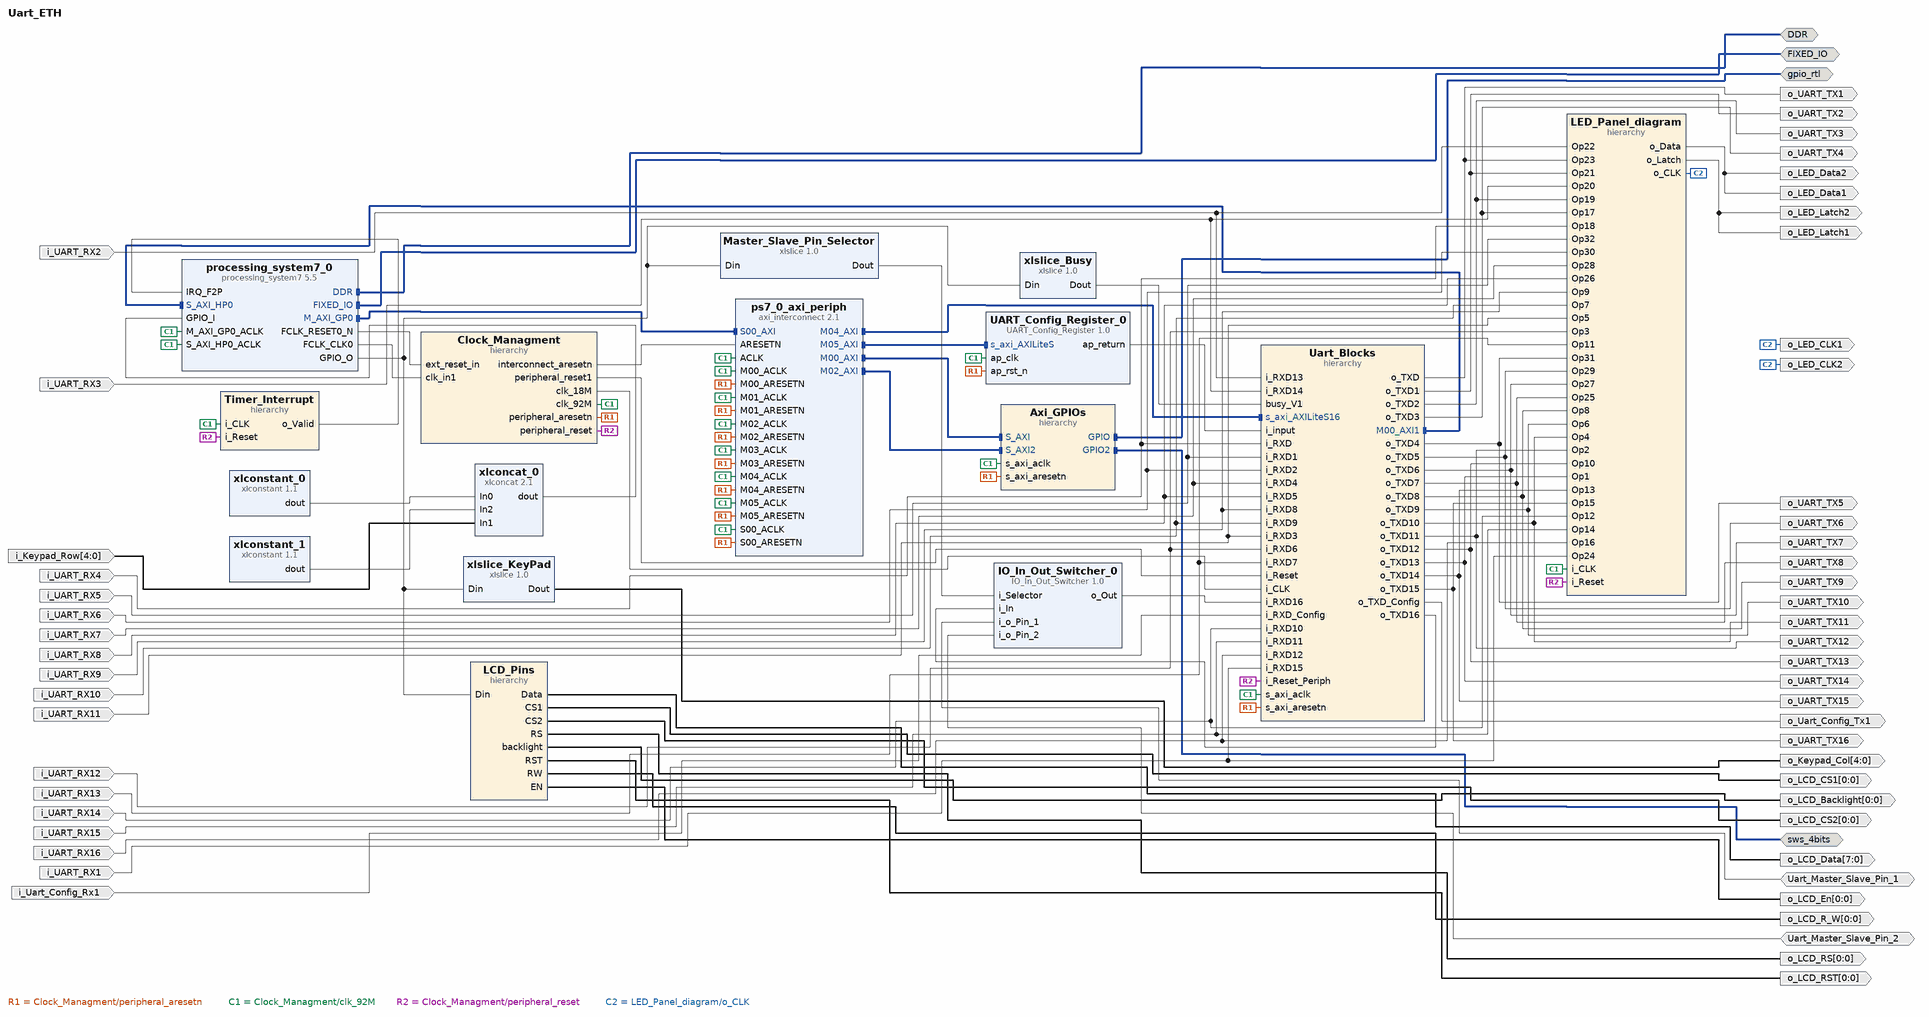
[diagram p0: block diagram of the top level]
# Vivado block design Uart_ETH, xc7z020clg400-1, Vivado 2017.2
create_bd_design Uart_ETH

create_bd_intf_port -mode Master -vlnv xilinx.com:interface:ddrx_rtl:1.0 DDR
create_bd_intf_port -mode Master -vlnv xilinx.com:display_processing_system7:fixedio_rtl:1.0 FIXED_IO
create_bd_intf_port -mode Master -vlnv xilinx.com:interface:gpio_rtl:1.0 gpio_rtl
create_bd_intf_port -mode Master -vlnv xilinx.com:interface:gpio_rtl:1.0 sws_4bits
create_bd_port -dir I i_UART_RX2
create_bd_port -dir I i_UART_RX3
create_bd_port -dir I i_UART_RX4
create_bd_port -dir I i_UART_RX5
create_bd_port -dir I i_UART_RX6
create_bd_port -dir I i_UART_RX7
create_bd_port -dir I i_UART_RX8
create_bd_port -dir I i_UART_RX9
create_bd_port -dir I i_UART_RX10
create_bd_port -dir I i_UART_RX11
create_bd_port -dir I i_UART_RX12
create_bd_port -dir I i_UART_RX13
create_bd_port -dir I i_UART_RX14
create_bd_port -dir I i_UART_RX15
create_bd_port -dir I i_UART_RX16
create_bd_port -dir I i_UART_RX1
create_bd_port -dir O o_UART_TX1
create_bd_port -dir O o_UART_TX2
create_bd_port -dir O o_UART_TX3
create_bd_port -dir O o_UART_TX4
create_bd_port -dir O o_UART_TX5
create_bd_port -dir O o_UART_TX6
create_bd_port -dir O o_UART_TX7
create_bd_port -dir O o_UART_TX8
create_bd_port -dir O o_UART_TX9
create_bd_port -dir O o_UART_TX10
create_bd_port -dir O o_UART_TX11
create_bd_port -dir O o_UART_TX12
create_bd_port -dir O o_UART_TX13
create_bd_port -dir O o_UART_TX14
create_bd_port -dir O o_UART_TX15
create_bd_port -dir O o_UART_TX16
create_bd_port -dir O -type clk o_LED_CLK1
create_bd_port -dir O -type clk o_LED_CLK2
create_bd_port -dir O o_LED_Data1
create_bd_port -dir O o_LED_Data2
create_bd_port -dir O o_LED_Latch1
create_bd_port -dir O o_LED_Latch2
create_bd_port -dir O -from 4 -to 0 o_Keypad_Col
create_bd_port -dir I -from 4 -to 0 i_Keypad_Row
create_bd_port -dir O -from 7 -to 0 o_LCD_Data
create_bd_port -dir O -from 0 -to 0 o_LCD_CS1
create_bd_port -dir O -from 0 -to 0 o_LCD_CS2
create_bd_port -dir O -from 0 -to 0 o_LCD_RS
create_bd_port -dir O -from 0 -to 0 o_LCD_RST
create_bd_port -dir O -from 0 -to 0 o_LCD_R_W
create_bd_port -dir O -from 0 -to 0 o_LCD_Backlight
create_bd_port -dir O -from 0 -to 0 o_LCD_En
create_bd_port -dir O o_Uart_Config_Tx1
create_bd_port -dir I i_Uart_Config_Rx1
create_bd_port -dir IO Uart_Master_Slave_Pin_1
create_bd_port -dir IO Uart_Master_Slave_Pin_2

create_bd_cell -type ip -vlnv xilinx.com:ip:processing_system7:5.5 processing_system7_0
set_property -dict [list \
  CONFIG.PCW_FCLK_CLK1_BUF TRUE \
  CONFIG.PCW_APU_PERIPHERAL_FREQMHZ 666.666666 \
  CONFIG.PCW_SDIO_PERIPHERAL_FREQMHZ 100 \
  CONFIG.PCW_UART_PERIPHERAL_FREQMHZ 100 \
  CONFIG.PCW_FPGA0_PERIPHERAL_FREQMHZ 100 \
  CONFIG.PCW_FPGA1_PERIPHERAL_FREQMHZ 125 \
  CONFIG.PCW_USE_S_AXI_HP0 1 \
  CONFIG.PCW_USE_FABRIC_INTERRUPT 1 \
  CONFIG.PCW_UART1_BAUD_RATE 921600 \
  CONFIG.PCW_EN_CLK1_PORT 1 \
  CONFIG.PCW_EN_RST1_PORT 1 \
  CONFIG.PCW_IRQ_F2P_INTR 1 \
  CONFIG.PCW_PRESET_BANK1_VOLTAGE {LVCMOS 1.8V} \
  CONFIG.PCW_UIPARAM_DDR_PARTNO {MT41J256M16 RE-125} \
  CONFIG.PCW_QSPI_PERIPHERAL_ENABLE 1 \
  CONFIG.PCW_QSPI_GRP_SINGLE_SS_ENABLE 1 \
  CONFIG.PCW_QSPI_GRP_SINGLE_SS_IO {MIO 1 .. 6} \
  CONFIG.PCW_QSPI_GRP_FBCLK_ENABLE 1 \
  CONFIG.PCW_QSPI_GRP_FBCLK_IO {MIO 8} \
  CONFIG.PCW_ENET0_PERIPHERAL_ENABLE 1 \
  CONFIG.PCW_ENET0_ENET0_IO {MIO 16 .. 27} \
  CONFIG.PCW_ENET0_GRP_MDIO_ENABLE 1 \
  CONFIG.PCW_ENET0_GRP_MDIO_IO {MIO 52 .. 53} \
  CONFIG.PCW_ENET0_RESET_ENABLE 1 \
  CONFIG.PCW_ENET0_RESET_IO {MIO 51} \
  CONFIG.PCW_SD0_PERIPHERAL_ENABLE 1 \
  CONFIG.PCW_SD0_SD0_IO {MIO 40 .. 45} \
  CONFIG.PCW_SD0_GRP_CD_ENABLE 1 \
  CONFIG.PCW_SD0_GRP_CD_IO {MIO 46} \
  CONFIG.PCW_SD0_GRP_WP_ENABLE 1 \
  CONFIG.PCW_SD0_GRP_WP_IO {MIO 47} \
  CONFIG.PCW_UART1_PERIPHERAL_ENABLE 1 \
  CONFIG.PCW_UART1_UART1_IO {MIO 48 .. 49} \
  CONFIG.PCW_USB0_PERIPHERAL_ENABLE 1 \
  CONFIG.PCW_USB0_USB0_IO {MIO 28 .. 39} \
  CONFIG.PCW_USB0_RESET_ENABLE 0 \
  CONFIG.PCW_GPIO_PERIPHERAL_ENABLE 1 \
  CONFIG.PCW_GPIO_MIO_GPIO_ENABLE 1 \
  CONFIG.PCW_GPIO_EMIO_GPIO_ENABLE 1 \
  CONFIG.PCW_GPIO_EMIO_GPIO_IO 44 \
  CONFIG.PCW_ENET0_PERIPHERAL_CLKSRC {ARM PLL} \
] [get_bd_cells processing_system7_0]
# 165 more settings of processing_system7_0 are not shown: defaults, MIO pin electricals, DDR timing, and values the tool derives
create_bd_cell -type hier Axi_GPIOs
create_bd_cell -type ip -vlnv xilinx.com:ip:axi_interconnect:2.1 ps7_0_axi_periph
set_property -dict {CONFIG.NUM_MI 6} [get_bd_cells ps7_0_axi_periph]
create_bd_cell -type hier Uart_Blocks
create_bd_cell -type hier Clock_Managment
create_bd_cell -type ip -vlnv xilinx.com:ip:xlslice:1.0 xlslice_Busy
set_property -dict {CONFIG.DIN_TO 0 CONFIG.DIN_FROM 17 CONFIG.DIN_WIDTH 44 CONFIG.DOUT_WIDTH 18} [get_bd_cells xlslice_Busy]
create_bd_cell -type ip -vlnv xilinx.com:ip:xlslice:1.0 xlslice_KeyPad
set_property -dict {CONFIG.DIN_TO 18 CONFIG.DIN_FROM 22 CONFIG.DIN_WIDTH 44 CONFIG.DOUT_WIDTH 5} [get_bd_cells xlslice_KeyPad]
create_bd_cell -type hier LCD_Pins
create_bd_cell -type hier Timer_Interrupt
create_bd_cell -type ip -vlnv xilinx.com:ip:xlconcat:2.1 xlconcat_0
set_property -dict {CONFIG.NUM_PORTS 3 CONFIG.IN0_WIDTH 38 CONFIG.IN1_WIDTH 5} [get_bd_cells xlconcat_0]
create_bd_cell -type ip -vlnv xilinx.com:ip:xlconstant:1.1 xlconstant_0
set_property -dict {CONFIG.CONST_WIDTH 38 CONFIG.CONST_VAL 0} [get_bd_cells xlconstant_0]
create_bd_cell -type ip -vlnv xilinx.com:hls:UART_Config_Register:1.0 UART_Config_Register_0
create_bd_cell -type ip -vlnv xilinx.com:user:IO_In_Out_Switcher:1.0 IO_In_Out_Switcher_0
create_bd_cell -type ip -vlnv xilinx.com:ip:xlconstant:1.1 xlconstant_1
set_property -dict {CONFIG.CONST_WIDTH 1 CONFIG.CONST_VAL 0} [get_bd_cells xlconstant_1]
create_bd_cell -type ip -vlnv xilinx.com:ip:xlslice:1.0 Master_Slave_Pin_Selector
set_property -dict [list \
  CONFIG.DIN_TO 43 \
  CONFIG.DIN_FROM 43 \
  CONFIG.DIN_WIDTH 44 \
  CONFIG.DOUT_WIDTH 1 \
] [get_bd_cells Master_Slave_Pin_Selector]
create_bd_cell -type hier LED_Panel_diagram

# ---- hierarchy /Axi_GPIOs ----
current_bd_instance /Axi_GPIOs
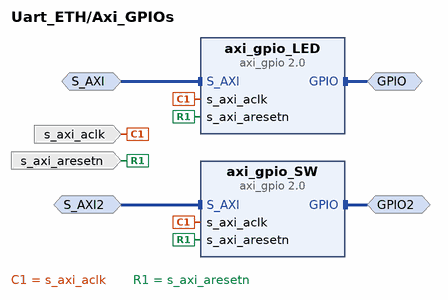
[diagram p1: block diagram inside /Axi_GPIOs]
create_bd_intf_pin -mode Slave -vlnv xilinx.com:interface:aximm_rtl:1.0 S_AXI
create_bd_intf_pin -mode Master -vlnv xilinx.com:interface:gpio_rtl:1.0 GPIO
create_bd_intf_pin -mode Slave -vlnv xilinx.com:interface:aximm_rtl:1.0 S_AXI2
create_bd_intf_pin -mode Master -vlnv xilinx.com:interface:gpio_rtl:1.0 GPIO2
create_bd_pin -dir I -type clk s_axi_aclk
create_bd_pin -dir I -type rst s_axi_aresetn

create_bd_cell -type ip -vlnv xilinx.com:ip:axi_gpio:2.0 axi_gpio_LED
set_property -dict [list \
  CONFIG.C_GPIO_WIDTH 4 \
  CONFIG.USE_BOARD_FLOW true \
  CONFIG.GPIO_BOARD_INTERFACE Custom \
  CONFIG.C_ALL_OUTPUTS 1 \
] [get_bd_cells axi_gpio_LED]
create_bd_cell -type ip -vlnv xilinx.com:ip:axi_gpio:2.0 axi_gpio_SW
set_property -dict {CONFIG.USE_BOARD_FLOW true CONFIG.GPIO_BOARD_INTERFACE sws_4bits} [get_bd_cells axi_gpio_SW]

# ---- hierarchy /Uart_Blocks ----
current_bd_instance /Uart_Blocks
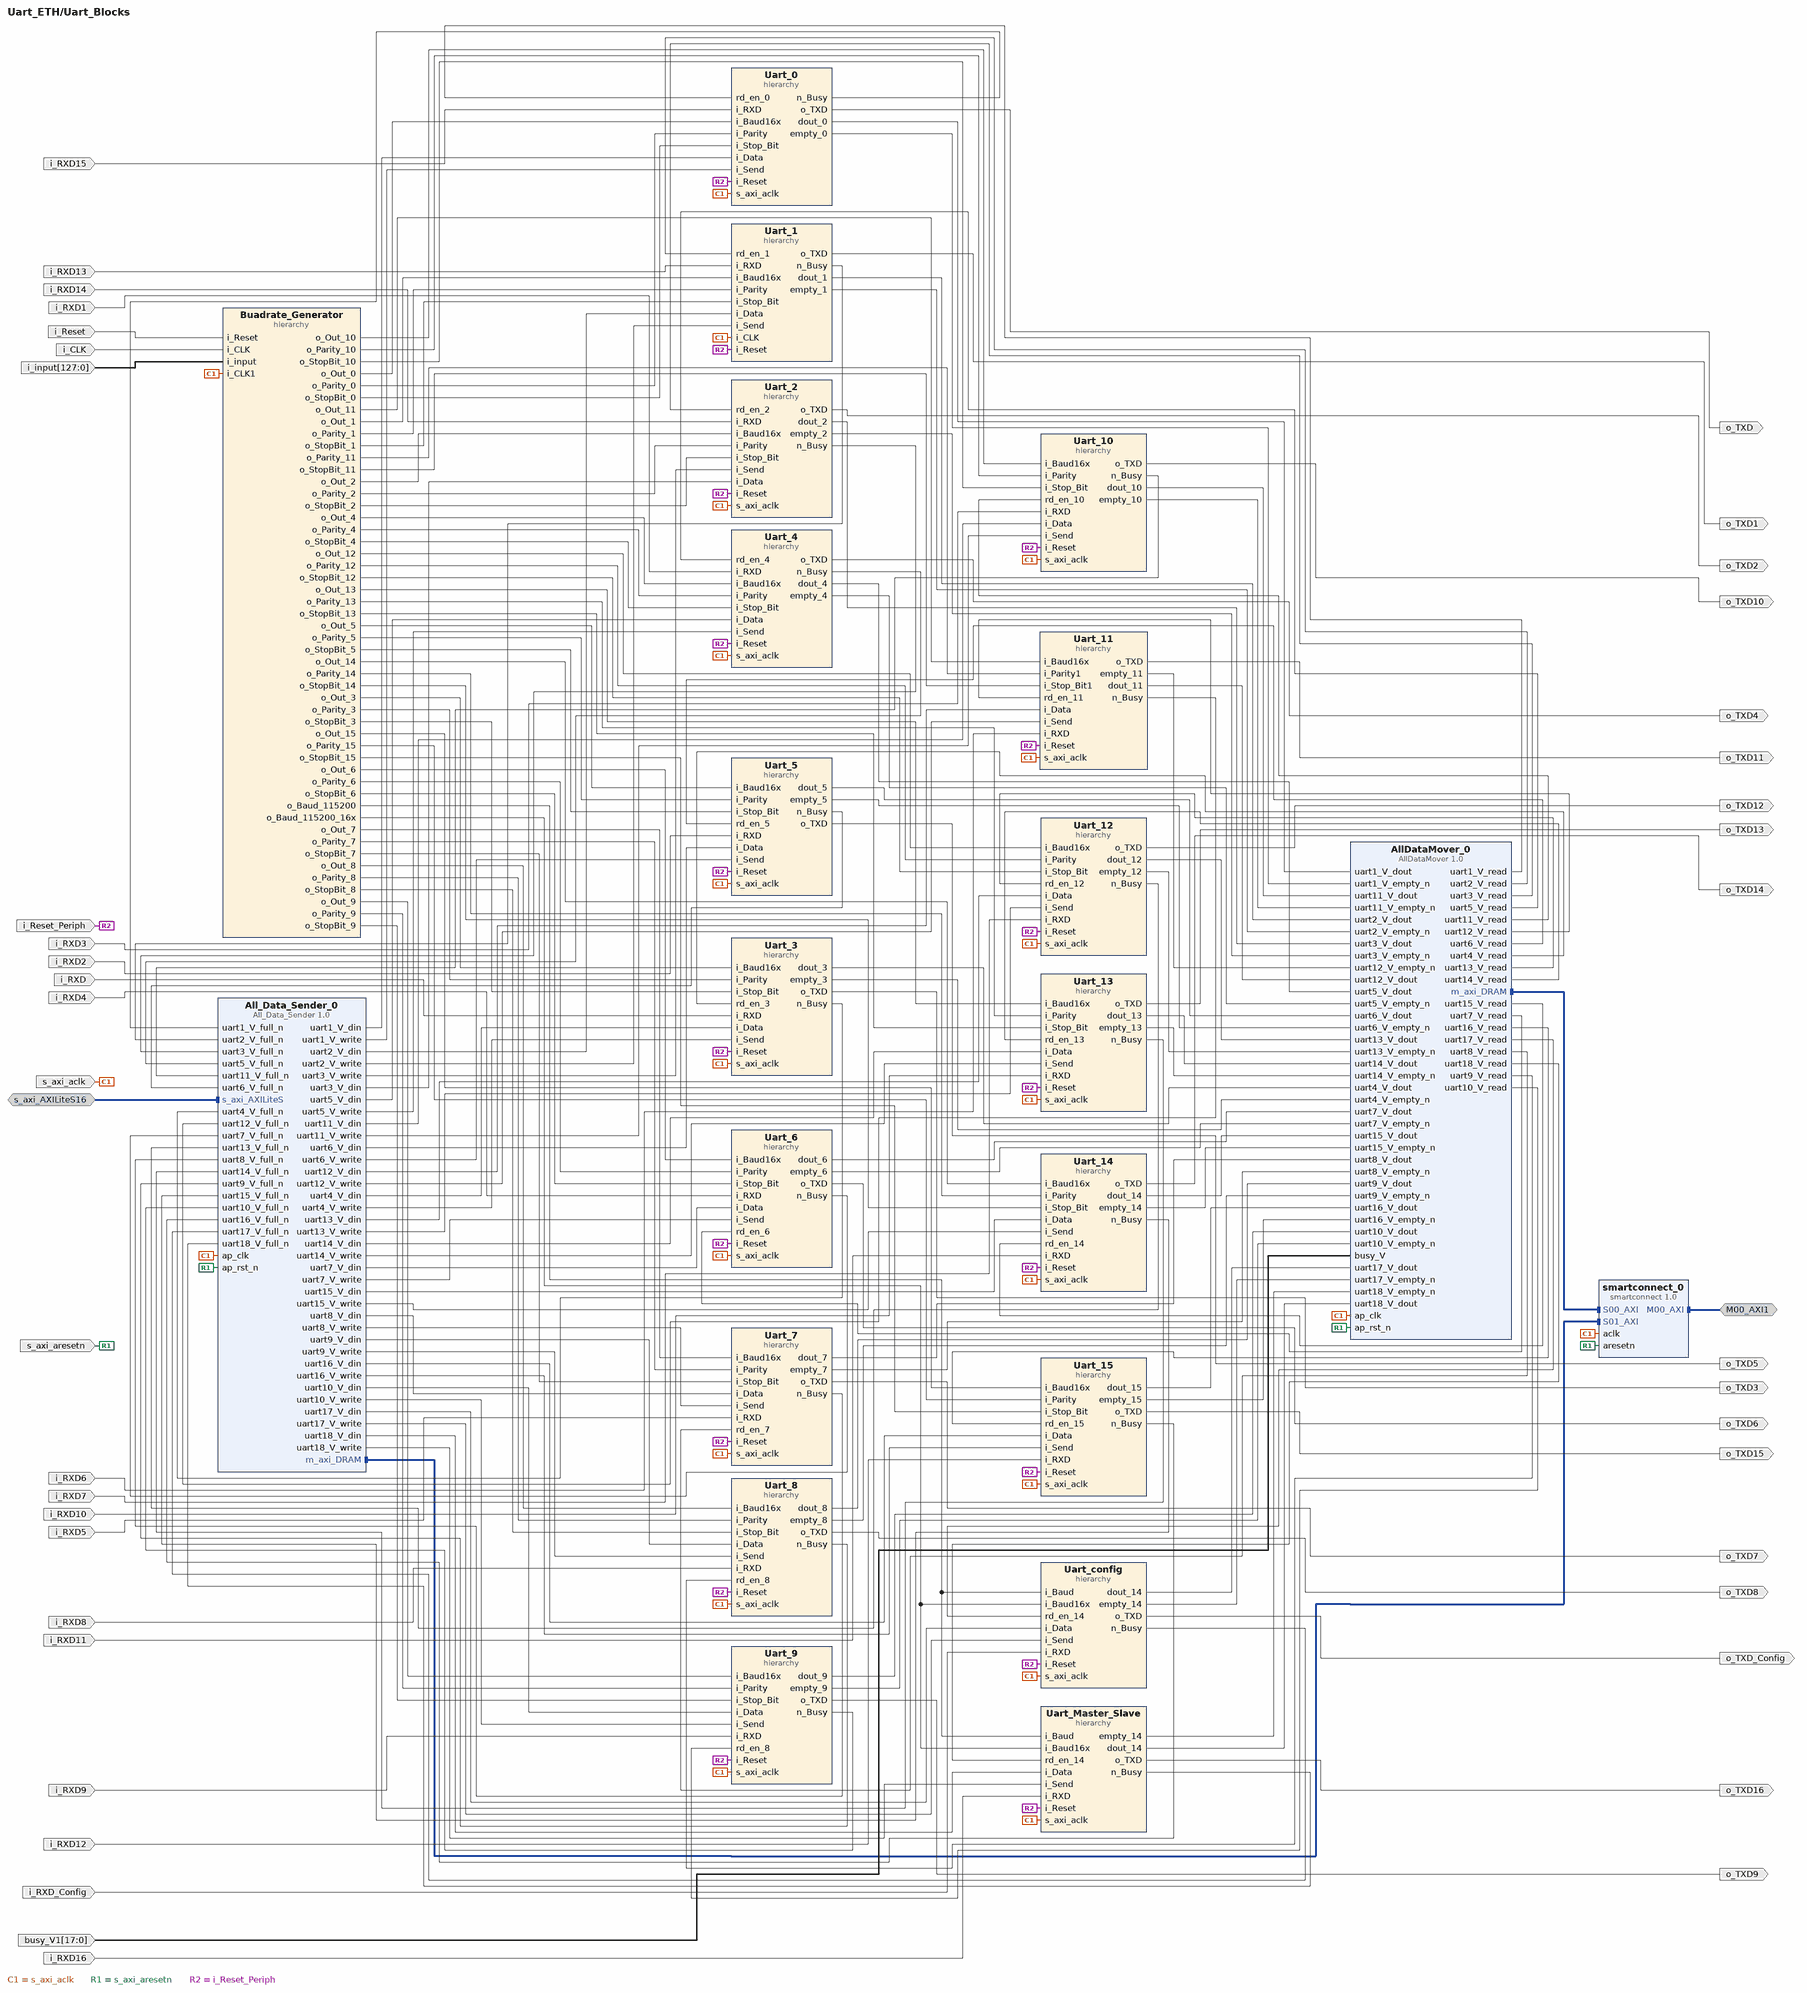
[diagram p2: block diagram inside /Uart_Blocks]
create_bd_intf_pin -mode Master -vlnv xilinx.com:interface:aximm_rtl:1.0 M00_AXI1
create_bd_intf_pin -mode Slave -vlnv xilinx.com:interface:aximm_rtl:1.0 s_axi_AXILiteS16
create_bd_pin -dir I -type clk s_axi_aclk
create_bd_pin -dir I -type rst s_axi_aresetn
create_bd_pin -dir I i_RXD
create_bd_pin -dir I i_RXD1
create_bd_pin -dir I i_RXD2
create_bd_pin -dir I i_RXD3
create_bd_pin -dir I i_RXD4
create_bd_pin -dir I i_RXD5
create_bd_pin -dir I i_RXD6
create_bd_pin -dir I i_RXD7
create_bd_pin -dir I i_RXD8
create_bd_pin -dir I i_RXD9
create_bd_pin -dir I i_RXD10
create_bd_pin -dir I i_RXD11
create_bd_pin -dir I i_RXD12
create_bd_pin -dir I i_RXD13
create_bd_pin -dir I -type rst i_Reset_Periph
create_bd_pin -dir I i_RXD14
create_bd_pin -dir I i_RXD15
create_bd_pin -dir O o_TXD
create_bd_pin -dir O o_TXD1
create_bd_pin -dir O o_TXD2
create_bd_pin -dir O o_TXD3
create_bd_pin -dir O o_TXD4
create_bd_pin -dir O o_TXD5
create_bd_pin -dir O o_TXD6
create_bd_pin -dir O o_TXD7
create_bd_pin -dir O o_TXD8
create_bd_pin -dir O o_TXD9
create_bd_pin -dir O o_TXD10
create_bd_pin -dir O o_TXD11
create_bd_pin -dir O o_TXD12
create_bd_pin -dir O o_TXD13
create_bd_pin -dir O o_TXD14
create_bd_pin -dir O o_TXD15
create_bd_pin -dir I -type rst i_Reset
create_bd_pin -dir I -type clk i_CLK
create_bd_pin -dir O o_TXD_Config
create_bd_pin -dir I i_RXD_Config
create_bd_pin -dir I -from 17 -to 0 -type data busy_V1
create_bd_pin -dir I -from 127 -to 0 i_input
create_bd_pin -dir I i_RXD16
create_bd_pin -dir O o_TXD16

create_bd_cell -type hier Uart_2
create_bd_cell -type hier Uart_3
create_bd_cell -type hier Uart_4
create_bd_cell -type hier Uart_5
create_bd_cell -type hier Uart_6
create_bd_cell -type hier Uart_7
create_bd_cell -type hier Uart_8
create_bd_cell -type hier Uart_9
create_bd_cell -type hier Uart_10
create_bd_cell -type hier Uart_11
create_bd_cell -type hier Uart_12
create_bd_cell -type hier Uart_13
create_bd_cell -type hier Uart_14
create_bd_cell -type hier Uart_15
create_bd_cell -type hier Uart_0
create_bd_cell -type hier Uart_1
create_bd_cell -type ip -vlnv xilinx.com:ip:smartconnect:1.0 smartconnect_0
set_property -dict {CONFIG.NUM_SI 2} [get_bd_cells smartconnect_0]
create_bd_cell -type hier Buadrate_Generator
create_bd_cell -type hier Uart_config
create_bd_cell -type ip -vlnv xilinx.com:hls:All_Data_Sender:1.0 All_Data_Sender_0
set_property -dict {CONFIG.C_M_AXI_DRAM_TARGET_ADDR 0x01200000} [get_bd_cells All_Data_Sender_0]
create_bd_cell -type ip -vlnv xilinx.com:hls:AllDataMover:1.0 AllDataMover_0
set_property -dict {CONFIG.C_M_AXI_DRAM_TARGET_ADDR 0x01100000} [get_bd_cells AllDataMover_0]
create_bd_cell -type hier Uart_Master_Slave

# ---- hierarchy /Uart_Blocks/Uart_2 ----
current_bd_instance /Uart_Blocks/Uart_2
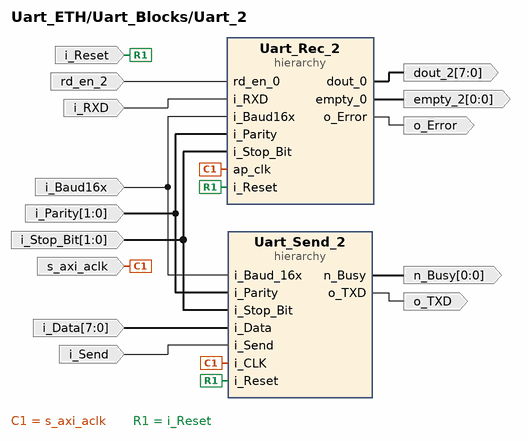
[diagram p3: block diagram inside /Uart_Blocks/Uart_2]
create_bd_pin -dir I -type clk s_axi_aclk
create_bd_pin -dir I i_RXD
create_bd_pin -dir I -type rst i_Reset
create_bd_pin -dir O -from 7 -to 0 dout_2
create_bd_pin -dir O -from 0 -to 0 empty_2
create_bd_pin -dir I rd_en_2
create_bd_pin -dir O -from 0 -to 0 n_Busy
create_bd_pin -dir O o_TXD
create_bd_pin -dir I i_Send
create_bd_pin -dir I -from 7 -to 0 i_Data
create_bd_pin -dir I i_Baud16x
create_bd_pin -dir I -from 1 -to 0 i_Parity
create_bd_pin -dir I -from 1 -to 0 i_Stop_Bit
create_bd_pin -dir O o_Error

create_bd_cell -type hier Uart_Send_2
create_bd_cell -type hier Uart_Rec_2

# ---- hierarchy /Uart_Blocks/Uart_2/Uart_Send_2 ----
current_bd_instance /Uart_Blocks/Uart_2/Uart_Send_2
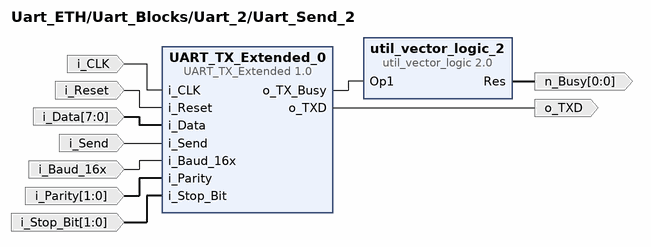
[diagram p4: block diagram inside /Uart_Blocks/Uart_2/Uart_Send_2]
create_bd_pin -dir O -from 0 -to 0 n_Busy
create_bd_pin -dir I -type clk i_CLK
create_bd_pin -dir I -type rst i_Reset
create_bd_pin -dir I -from 7 -to 0 i_Data
create_bd_pin -dir I i_Send
create_bd_pin -dir O o_TXD
create_bd_pin -dir I i_Baud_16x
create_bd_pin -dir I -from 1 -to 0 i_Parity
create_bd_pin -dir I -from 1 -to 0 i_Stop_Bit

create_bd_cell -type ip -vlnv xilinx.com:ip:util_vector_logic:2.0 util_vector_logic_2
set_property -dict {CONFIG.C_SIZE 1 CONFIG.C_OPERATION not} [get_bd_cells util_vector_logic_2]
create_bd_cell -type ip -vlnv xilinx.com:user:UART_TX_Extended:1.0 UART_TX_Extended_0

# ---- hierarchy /Uart_Blocks/Uart_2/Uart_Rec_2 ----
current_bd_instance /Uart_Blocks/Uart_2/Uart_Rec_2
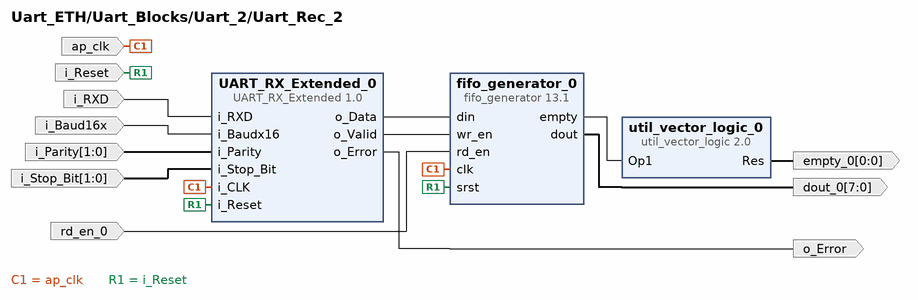
[diagram p5: block diagram inside /Uart_Blocks/Uart_2/Uart_Rec_2]
create_bd_pin -dir I -type clk ap_clk
create_bd_pin -dir I i_RXD
create_bd_pin -dir I -type rst i_Reset
create_bd_pin -dir O -from 7 -to 0 dout_0
create_bd_pin -dir I rd_en_0
create_bd_pin -dir O -from 0 -to 0 empty_0
create_bd_pin -dir I i_Baud16x
create_bd_pin -dir I -from 1 -to 0 i_Parity
create_bd_pin -dir I -from 1 -to 0 i_Stop_Bit
create_bd_pin -dir O o_Error

create_bd_cell -type ip -vlnv xilinx.com:ip:util_vector_logic:2.0 util_vector_logic_0
set_property -dict {CONFIG.C_SIZE 1 CONFIG.C_OPERATION not} [get_bd_cells util_vector_logic_0]
create_bd_cell -type ip -vlnv xilinx.com:ip:fifo_generator:13.1 fifo_generator_0
set_property -dict [list \
  CONFIG.Performance_Options First_Word_Fall_Through \
  CONFIG.Input_Data_Width 8 \
  CONFIG.Input_Depth 256 \
  CONFIG.Output_Data_Width 8 \
  CONFIG.Data_Count true \
  CONFIG.Data_Count_Width 9 \
] [get_bd_cells fifo_generator_0]
create_bd_cell -type ip -vlnv xilinx.com:user:UART_RX_Extended:1.0 UART_RX_Extended_0

# ---- hierarchy /Uart_Blocks/Uart_3 ----
current_bd_instance /Uart_Blocks/Uart_3
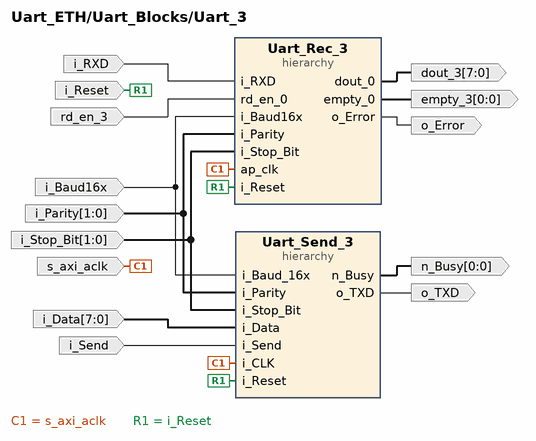
[diagram p6: block diagram inside /Uart_Blocks/Uart_3]
create_bd_pin -dir O -from 7 -to 0 dout_3
create_bd_pin -dir O -from 0 -to 0 n_Busy
create_bd_pin -dir I -from 7 -to 0 i_Data
create_bd_pin -dir O -from 0 -to 0 empty_3
create_bd_pin -dir I i_RXD
create_bd_pin -dir I -type clk s_axi_aclk
create_bd_pin -dir I -type rst i_Reset
create_bd_pin -dir I i_Baud16x
create_bd_pin -dir O o_TXD
create_bd_pin -dir I i_Send
create_bd_pin -dir I rd_en_3
create_bd_pin -dir I -from 1 -to 0 i_Parity
create_bd_pin -dir I -from 1 -to 0 i_Stop_Bit
create_bd_pin -dir O o_Error

create_bd_cell -type hier Uart_Rec_3
create_bd_cell -type hier Uart_Send_3

# ---- hierarchy /Uart_Blocks/Uart_3/Uart_Rec_3 ----
current_bd_instance /Uart_Blocks/Uart_3/Uart_Rec_3
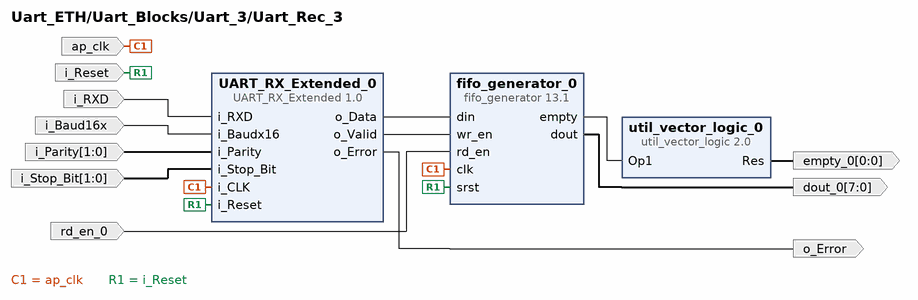
[diagram p7: block diagram inside /Uart_Blocks/Uart_3/Uart_Rec_3]
create_bd_pin -dir I -type clk ap_clk
create_bd_pin -dir I i_RXD
create_bd_pin -dir I -type rst i_Reset
create_bd_pin -dir O -from 7 -to 0 dout_0
create_bd_pin -dir I rd_en_0
create_bd_pin -dir O -from 0 -to 0 empty_0
create_bd_pin -dir I i_Baud16x
create_bd_pin -dir I -from 1 -to 0 i_Parity
create_bd_pin -dir I -from 1 -to 0 i_Stop_Bit
create_bd_pin -dir O o_Error

create_bd_cell -type ip -vlnv xilinx.com:ip:util_vector_logic:2.0 util_vector_logic_0
set_property -dict {CONFIG.C_SIZE 1 CONFIG.C_OPERATION not} [get_bd_cells util_vector_logic_0]
create_bd_cell -type ip -vlnv xilinx.com:ip:fifo_generator:13.1 fifo_generator_0
set_property -dict [list \
  CONFIG.Performance_Options First_Word_Fall_Through \
  CONFIG.Input_Data_Width 8 \
  CONFIG.Input_Depth 256 \
  CONFIG.Output_Data_Width 8 \
  CONFIG.Data_Count true \
  CONFIG.Data_Count_Width 9 \
] [get_bd_cells fifo_generator_0]
create_bd_cell -type ip -vlnv xilinx.com:user:UART_RX_Extended:1.0 UART_RX_Extended_0

# ---- hierarchy /Uart_Blocks/Uart_3/Uart_Send_3 ----
current_bd_instance /Uart_Blocks/Uart_3/Uart_Send_3
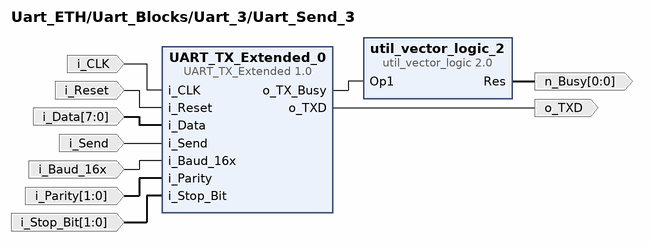
[diagram p8: block diagram inside /Uart_Blocks/Uart_3/Uart_Send_3]
create_bd_pin -dir O -from 0 -to 0 n_Busy
create_bd_pin -dir I -type clk i_CLK
create_bd_pin -dir I -type rst i_Reset
create_bd_pin -dir I -from 7 -to 0 i_Data
create_bd_pin -dir I i_Send
create_bd_pin -dir O o_TXD
create_bd_pin -dir I i_Baud_16x
create_bd_pin -dir I -from 1 -to 0 i_Parity
create_bd_pin -dir I -from 1 -to 0 i_Stop_Bit

create_bd_cell -type ip -vlnv xilinx.com:ip:util_vector_logic:2.0 util_vector_logic_2
set_property -dict {CONFIG.C_SIZE 1 CONFIG.C_OPERATION not} [get_bd_cells util_vector_logic_2]
create_bd_cell -type ip -vlnv xilinx.com:user:UART_TX_Extended:1.0 UART_TX_Extended_0

# ---- hierarchy /Uart_Blocks/Uart_4 ----
current_bd_instance /Uart_Blocks/Uart_4
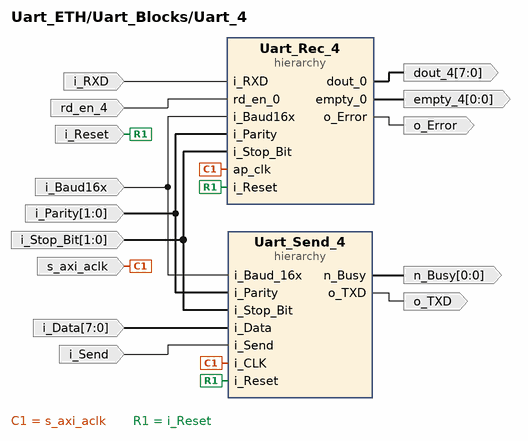
[diagram p9: block diagram inside /Uart_Blocks/Uart_4]
create_bd_pin -dir I -type clk s_axi_aclk
create_bd_pin -dir I i_RXD
create_bd_pin -dir I -type rst i_Reset
create_bd_pin -dir O -from 7 -to 0 dout_4
create_bd_pin -dir O -from 0 -to 0 empty_4
create_bd_pin -dir I rd_en_4
create_bd_pin -dir I -from 7 -to 0 i_Data
create_bd_pin -dir I i_Send
create_bd_pin -dir O -from 0 -to 0 n_Busy
create_bd_pin -dir O o_TXD
create_bd_pin -dir I i_Baud16x
create_bd_pin -dir I -from 1 -to 0 i_Parity
create_bd_pin -dir I -from 1 -to 0 i_Stop_Bit
create_bd_pin -dir O o_Error

create_bd_cell -type hier Uart_Rec_4
create_bd_cell -type hier Uart_Send_4

# ---- hierarchy /Uart_Blocks/Uart_4/Uart_Rec_4 ----
current_bd_instance /Uart_Blocks/Uart_4/Uart_Rec_4
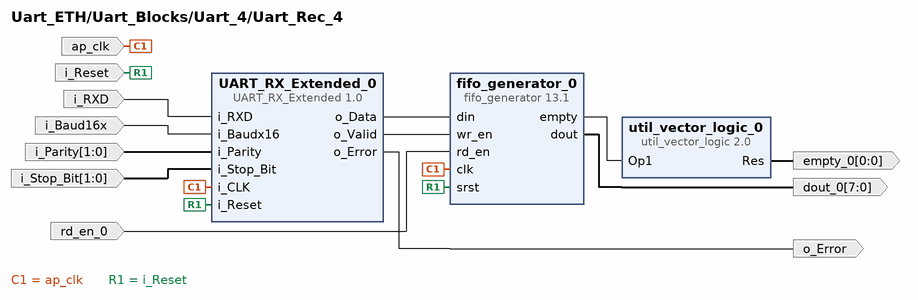
[diagram p10: block diagram inside /Uart_Blocks/Uart_4/Uart_Rec_4]
create_bd_pin -dir I -type clk ap_clk
create_bd_pin -dir I i_RXD
create_bd_pin -dir I -type rst i_Reset
create_bd_pin -dir O -from 7 -to 0 dout_0
create_bd_pin -dir I rd_en_0
create_bd_pin -dir O -from 0 -to 0 empty_0
create_bd_pin -dir I i_Baud16x
create_bd_pin -dir I -from 1 -to 0 i_Parity
create_bd_pin -dir I -from 1 -to 0 i_Stop_Bit
create_bd_pin -dir O o_Error

create_bd_cell -type ip -vlnv xilinx.com:ip:util_vector_logic:2.0 util_vector_logic_0
set_property -dict {CONFIG.C_SIZE 1 CONFIG.C_OPERATION not} [get_bd_cells util_vector_logic_0]
create_bd_cell -type ip -vlnv xilinx.com:ip:fifo_generator:13.1 fifo_generator_0
set_property -dict [list \
  CONFIG.Performance_Options First_Word_Fall_Through \
  CONFIG.Input_Data_Width 8 \
  CONFIG.Input_Depth 256 \
  CONFIG.Output_Data_Width 8 \
  CONFIG.Data_Count true \
  CONFIG.Data_Count_Width 9 \
] [get_bd_cells fifo_generator_0]
create_bd_cell -type ip -vlnv xilinx.com:user:UART_RX_Extended:1.0 UART_RX_Extended_0

# ---- hierarchy /Uart_Blocks/Uart_4/Uart_Send_4 ----
current_bd_instance /Uart_Blocks/Uart_4/Uart_Send_4
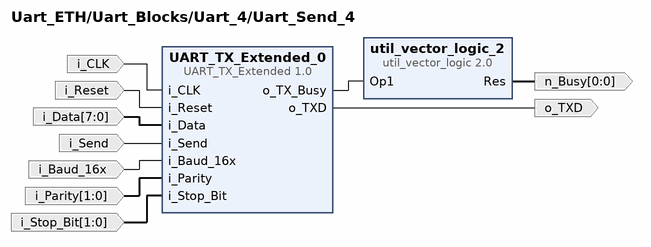
[diagram p11: block diagram inside /Uart_Blocks/Uart_4/Uart_Send_4]
create_bd_pin -dir O -from 0 -to 0 n_Busy
create_bd_pin -dir I -type clk i_CLK
create_bd_pin -dir I -type rst i_Reset
create_bd_pin -dir I -from 7 -to 0 i_Data
create_bd_pin -dir I i_Send
create_bd_pin -dir O o_TXD
create_bd_pin -dir I i_Baud_16x
create_bd_pin -dir I -from 1 -to 0 i_Parity
create_bd_pin -dir I -from 1 -to 0 i_Stop_Bit

create_bd_cell -type ip -vlnv xilinx.com:ip:util_vector_logic:2.0 util_vector_logic_2
set_property -dict {CONFIG.C_SIZE 1 CONFIG.C_OPERATION not} [get_bd_cells util_vector_logic_2]
create_bd_cell -type ip -vlnv xilinx.com:user:UART_TX_Extended:1.0 UART_TX_Extended_0

# ---- hierarchy /Uart_Blocks/Uart_5 ----
current_bd_instance /Uart_Blocks/Uart_5
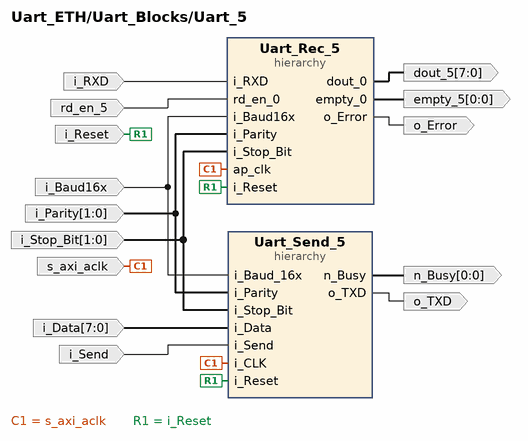
[diagram p12: block diagram inside /Uart_Blocks/Uart_5]
create_bd_pin -dir I -type clk s_axi_aclk
create_bd_pin -dir I i_RXD
create_bd_pin -dir I -type rst i_Reset
create_bd_pin -dir O -from 7 -to 0 dout_5
create_bd_pin -dir O -from 0 -to 0 empty_5
create_bd_pin -dir I rd_en_5
create_bd_pin -dir I -from 7 -to 0 i_Data
create_bd_pin -dir I i_Send
create_bd_pin -dir O -from 0 -to 0 n_Busy
create_bd_pin -dir O o_TXD
create_bd_pin -dir I i_Baud16x
create_bd_pin -dir I -from 1 -to 0 i_Parity
create_bd_pin -dir I -from 1 -to 0 i_Stop_Bit
create_bd_pin -dir O o_Error

create_bd_cell -type hier Uart_Rec_5
create_bd_cell -type hier Uart_Send_5

# ---- hierarchy /Uart_Blocks/Uart_5/Uart_Rec_5 ----
current_bd_instance /Uart_Blocks/Uart_5/Uart_Rec_5
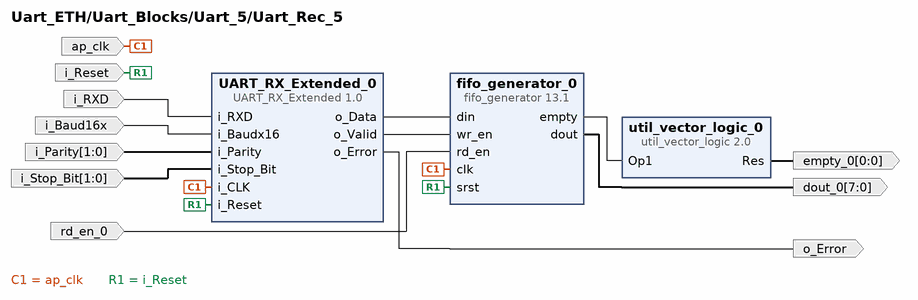
[diagram p13: block diagram inside /Uart_Blocks/Uart_5/Uart_Rec_5]
create_bd_pin -dir I -type clk ap_clk
create_bd_pin -dir I i_RXD
create_bd_pin -dir I -type rst i_Reset
create_bd_pin -dir O -from 7 -to 0 dout_0
create_bd_pin -dir I rd_en_0
create_bd_pin -dir O -from 0 -to 0 empty_0
create_bd_pin -dir I i_Baud16x
create_bd_pin -dir I -from 1 -to 0 i_Parity
create_bd_pin -dir I -from 1 -to 0 i_Stop_Bit
create_bd_pin -dir O o_Error

create_bd_cell -type ip -vlnv xilinx.com:ip:util_vector_logic:2.0 util_vector_logic_0
set_property -dict {CONFIG.C_SIZE 1 CONFIG.C_OPERATION not} [get_bd_cells util_vector_logic_0]
create_bd_cell -type ip -vlnv xilinx.com:ip:fifo_generator:13.1 fifo_generator_0
set_property -dict [list \
  CONFIG.Performance_Options First_Word_Fall_Through \
  CONFIG.Input_Data_Width 8 \
  CONFIG.Input_Depth 256 \
  CONFIG.Output_Data_Width 8 \
  CONFIG.Data_Count true \
  CONFIG.Data_Count_Width 9 \
] [get_bd_cells fifo_generator_0]
create_bd_cell -type ip -vlnv xilinx.com:user:UART_RX_Extended:1.0 UART_RX_Extended_0

# ---- hierarchy /Uart_Blocks/Uart_5/Uart_Send_5 ----
current_bd_instance /Uart_Blocks/Uart_5/Uart_Send_5
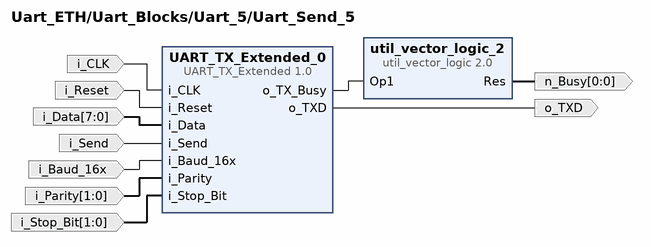
[diagram p14: block diagram inside /Uart_Blocks/Uart_5/Uart_Send_5]
create_bd_pin -dir O -from 0 -to 0 n_Busy
create_bd_pin -dir I -type clk i_CLK
create_bd_pin -dir I -type rst i_Reset
create_bd_pin -dir I -from 7 -to 0 i_Data
create_bd_pin -dir I i_Send
create_bd_pin -dir O o_TXD
create_bd_pin -dir I i_Baud_16x
create_bd_pin -dir I -from 1 -to 0 i_Parity
create_bd_pin -dir I -from 1 -to 0 i_Stop_Bit

create_bd_cell -type ip -vlnv xilinx.com:ip:util_vector_logic:2.0 util_vector_logic_2
set_property -dict {CONFIG.C_SIZE 1 CONFIG.C_OPERATION not} [get_bd_cells util_vector_logic_2]
create_bd_cell -type ip -vlnv xilinx.com:user:UART_TX_Extended:1.0 UART_TX_Extended_0

# ---- hierarchy /Uart_Blocks/Uart_6 ----
current_bd_instance /Uart_Blocks/Uart_6
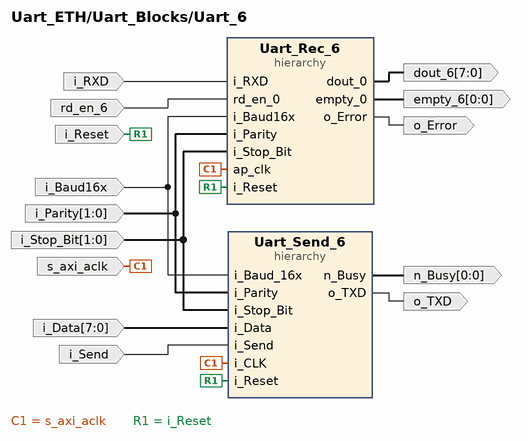
[diagram p15: block diagram inside /Uart_Blocks/Uart_6]
create_bd_pin -dir I -type clk s_axi_aclk
create_bd_pin -dir I i_RXD
create_bd_pin -dir I -type rst i_Reset
create_bd_pin -dir O -from 7 -to 0 dout_6
create_bd_pin -dir O -from 0 -to 0 empty_6
create_bd_pin -dir I rd_en_6
create_bd_pin -dir I -from 7 -to 0 i_Data
create_bd_pin -dir I i_Send
create_bd_pin -dir O -from 0 -to 0 n_Busy
create_bd_pin -dir O o_TXD
create_bd_pin -dir I i_Baud16x
create_bd_pin -dir I -from 1 -to 0 i_Parity
create_bd_pin -dir I -from 1 -to 0 i_Stop_Bit
create_bd_pin -dir O o_Error

create_bd_cell -type hier Uart_Rec_6
create_bd_cell -type hier Uart_Send_6

# ---- hierarchy /Uart_Blocks/Uart_6/Uart_Rec_6 ----
current_bd_instance /Uart_Blocks/Uart_6/Uart_Rec_6
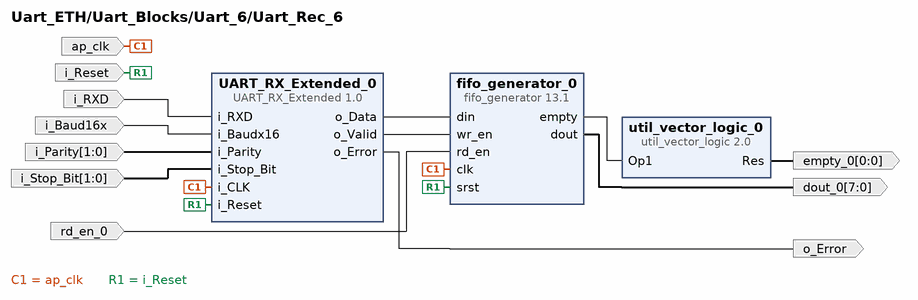
[diagram p16: block diagram inside /Uart_Blocks/Uart_6/Uart_Rec_6]
create_bd_pin -dir I -type clk ap_clk
create_bd_pin -dir I i_RXD
create_bd_pin -dir I -type rst i_Reset
create_bd_pin -dir O -from 7 -to 0 dout_0
create_bd_pin -dir I rd_en_0
create_bd_pin -dir O -from 0 -to 0 empty_0
create_bd_pin -dir I i_Baud16x
create_bd_pin -dir I -from 1 -to 0 i_Parity
create_bd_pin -dir I -from 1 -to 0 i_Stop_Bit
create_bd_pin -dir O o_Error

create_bd_cell -type ip -vlnv xilinx.com:ip:util_vector_logic:2.0 util_vector_logic_0
set_property -dict {CONFIG.C_SIZE 1 CONFIG.C_OPERATION not} [get_bd_cells util_vector_logic_0]
create_bd_cell -type ip -vlnv xilinx.com:ip:fifo_generator:13.1 fifo_generator_0
set_property -dict [list \
  CONFIG.Performance_Options First_Word_Fall_Through \
  CONFIG.Input_Data_Width 8 \
  CONFIG.Input_Depth 256 \
  CONFIG.Output_Data_Width 8 \
  CONFIG.Data_Count true \
  CONFIG.Data_Count_Width 9 \
] [get_bd_cells fifo_generator_0]
create_bd_cell -type ip -vlnv xilinx.com:user:UART_RX_Extended:1.0 UART_RX_Extended_0

# ---- hierarchy /Uart_Blocks/Uart_6/Uart_Send_6 ----
current_bd_instance /Uart_Blocks/Uart_6/Uart_Send_6
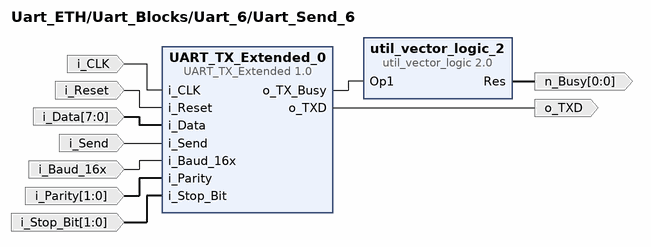
[diagram p17: block diagram inside /Uart_Blocks/Uart_6/Uart_Send_6]
create_bd_pin -dir O -from 0 -to 0 n_Busy
create_bd_pin -dir I -type clk i_CLK
create_bd_pin -dir I -type rst i_Reset
create_bd_pin -dir I -from 7 -to 0 i_Data
create_bd_pin -dir I i_Send
create_bd_pin -dir O o_TXD
create_bd_pin -dir I i_Baud_16x
create_bd_pin -dir I -from 1 -to 0 i_Parity
create_bd_pin -dir I -from 1 -to 0 i_Stop_Bit

create_bd_cell -type ip -vlnv xilinx.com:ip:util_vector_logic:2.0 util_vector_logic_2
set_property -dict {CONFIG.C_SIZE 1 CONFIG.C_OPERATION not} [get_bd_cells util_vector_logic_2]
create_bd_cell -type ip -vlnv xilinx.com:user:UART_TX_Extended:1.0 UART_TX_Extended_0

# ---- hierarchy /Uart_Blocks/Uart_7 ----
current_bd_instance /Uart_Blocks/Uart_7
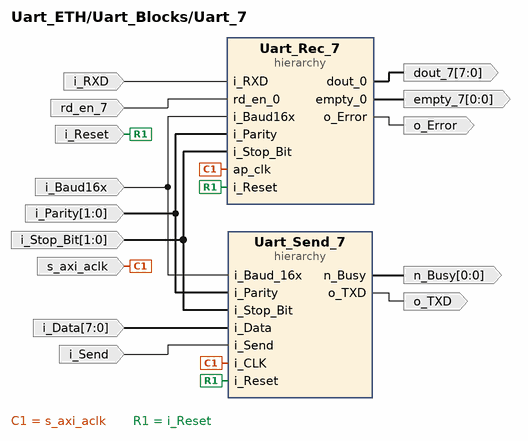
[diagram p18: block diagram inside /Uart_Blocks/Uart_7]
create_bd_pin -dir I -type clk s_axi_aclk
create_bd_pin -dir I i_RXD
create_bd_pin -dir I -type rst i_Reset
create_bd_pin -dir O -from 7 -to 0 dout_7
create_bd_pin -dir O -from 0 -to 0 empty_7
create_bd_pin -dir I rd_en_7
create_bd_pin -dir I -from 7 -to 0 i_Data
create_bd_pin -dir I i_Send
create_bd_pin -dir O -from 0 -to 0 n_Busy
create_bd_pin -dir O o_TXD
create_bd_pin -dir I i_Baud16x
create_bd_pin -dir I -from 1 -to 0 i_Parity
create_bd_pin -dir I -from 1 -to 0 i_Stop_Bit
create_bd_pin -dir O o_Error

create_bd_cell -type hier Uart_Rec_7
create_bd_cell -type hier Uart_Send_7

# ---- hierarchy /Uart_Blocks/Uart_7/Uart_Rec_7 ----
current_bd_instance /Uart_Blocks/Uart_7/Uart_Rec_7
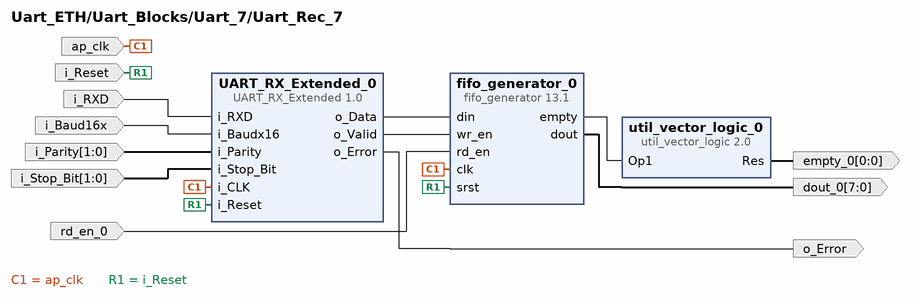
[diagram p19: block diagram inside /Uart_Blocks/Uart_7/Uart_Rec_7]
create_bd_pin -dir I -type clk ap_clk
create_bd_pin -dir I i_RXD
create_bd_pin -dir I -type rst i_Reset
create_bd_pin -dir O -from 7 -to 0 dout_0
create_bd_pin -dir I rd_en_0
create_bd_pin -dir O -from 0 -to 0 empty_0
create_bd_pin -dir I i_Baud16x
create_bd_pin -dir I -from 1 -to 0 i_Parity
create_bd_pin -dir I -from 1 -to 0 i_Stop_Bit
create_bd_pin -dir O o_Error

create_bd_cell -type ip -vlnv xilinx.com:ip:util_vector_logic:2.0 util_vector_logic_0
set_property -dict {CONFIG.C_SIZE 1 CONFIG.C_OPERATION not} [get_bd_cells util_vector_logic_0]
create_bd_cell -type ip -vlnv xilinx.com:ip:fifo_generator:13.1 fifo_generator_0
set_property -dict [list \
  CONFIG.Performance_Options First_Word_Fall_Through \
  CONFIG.Input_Data_Width 8 \
  CONFIG.Input_Depth 256 \
  CONFIG.Output_Data_Width 8 \
  CONFIG.Data_Count true \
  CONFIG.Data_Count_Width 9 \
] [get_bd_cells fifo_generator_0]
create_bd_cell -type ip -vlnv xilinx.com:user:UART_RX_Extended:1.0 UART_RX_Extended_0

# ---- hierarchy /Uart_Blocks/Uart_7/Uart_Send_7 ----
current_bd_instance /Uart_Blocks/Uart_7/Uart_Send_7
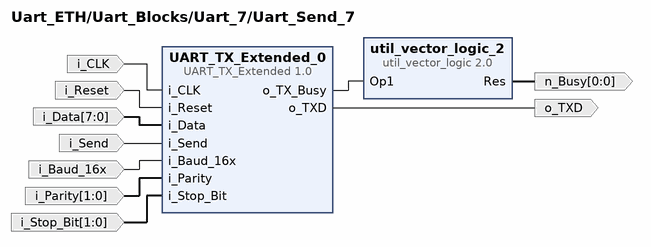
[diagram p20: block diagram inside /Uart_Blocks/Uart_7/Uart_Send_7]
create_bd_pin -dir O -from 0 -to 0 n_Busy
create_bd_pin -dir I -type clk i_CLK
create_bd_pin -dir I -type rst i_Reset
create_bd_pin -dir I -from 7 -to 0 i_Data
create_bd_pin -dir I i_Send
create_bd_pin -dir O o_TXD
create_bd_pin -dir I i_Baud_16x
create_bd_pin -dir I -from 1 -to 0 i_Parity
create_bd_pin -dir I -from 1 -to 0 i_Stop_Bit

create_bd_cell -type ip -vlnv xilinx.com:ip:util_vector_logic:2.0 util_vector_logic_2
set_property -dict {CONFIG.C_SIZE 1 CONFIG.C_OPERATION not} [get_bd_cells util_vector_logic_2]
create_bd_cell -type ip -vlnv xilinx.com:user:UART_TX_Extended:1.0 UART_TX_Extended_0

# ---- hierarchy /Uart_Blocks/Uart_8 ----
current_bd_instance /Uart_Blocks/Uart_8
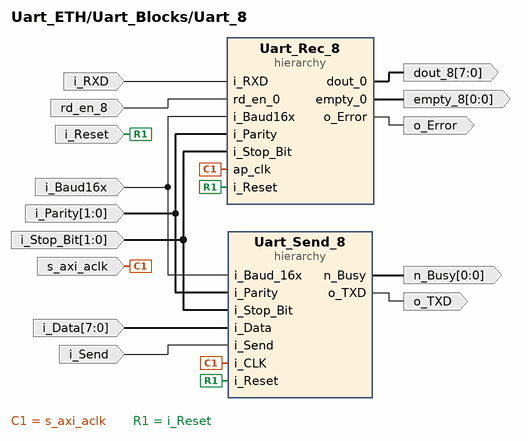
[diagram p21: block diagram inside /Uart_Blocks/Uart_8]
create_bd_pin -dir I -type clk s_axi_aclk
create_bd_pin -dir I i_RXD
create_bd_pin -dir I -type rst i_Reset
create_bd_pin -dir O -from 7 -to 0 dout_8
create_bd_pin -dir O -from 0 -to 0 empty_8
create_bd_pin -dir I rd_en_8
create_bd_pin -dir I -from 7 -to 0 i_Data
create_bd_pin -dir I i_Send
create_bd_pin -dir O -from 0 -to 0 n_Busy
create_bd_pin -dir O o_TXD
create_bd_pin -dir I i_Baud16x
create_bd_pin -dir I -from 1 -to 0 i_Parity
create_bd_pin -dir I -from 1 -to 0 i_Stop_Bit
create_bd_pin -dir O o_Error

create_bd_cell -type hier Uart_Rec_8
create_bd_cell -type hier Uart_Send_8

# ---- hierarchy /Uart_Blocks/Uart_8/Uart_Rec_8 ----
current_bd_instance /Uart_Blocks/Uart_8/Uart_Rec_8
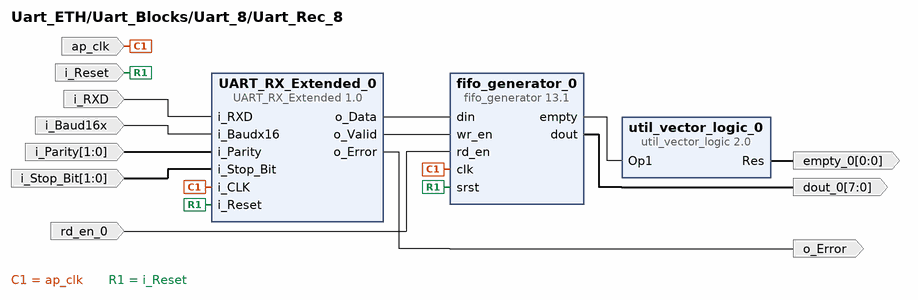
[diagram p22: block diagram inside /Uart_Blocks/Uart_8/Uart_Rec_8]
create_bd_pin -dir I -type clk ap_clk
create_bd_pin -dir I i_RXD
create_bd_pin -dir I -type rst i_Reset
create_bd_pin -dir O -from 7 -to 0 dout_0
create_bd_pin -dir I rd_en_0
create_bd_pin -dir O -from 0 -to 0 empty_0
create_bd_pin -dir I i_Baud16x
create_bd_pin -dir I -from 1 -to 0 i_Parity
create_bd_pin -dir I -from 1 -to 0 i_Stop_Bit
create_bd_pin -dir O o_Error

create_bd_cell -type ip -vlnv xilinx.com:ip:util_vector_logic:2.0 util_vector_logic_0
set_property -dict {CONFIG.C_SIZE 1 CONFIG.C_OPERATION not} [get_bd_cells util_vector_logic_0]
create_bd_cell -type ip -vlnv xilinx.com:ip:fifo_generator:13.1 fifo_generator_0
set_property -dict [list \
  CONFIG.Performance_Options First_Word_Fall_Through \
  CONFIG.Input_Data_Width 8 \
  CONFIG.Input_Depth 256 \
  CONFIG.Output_Data_Width 8 \
  CONFIG.Data_Count true \
  CONFIG.Data_Count_Width 9 \
] [get_bd_cells fifo_generator_0]
create_bd_cell -type ip -vlnv xilinx.com:user:UART_RX_Extended:1.0 UART_RX_Extended_0

# ---- hierarchy /Uart_Blocks/Uart_8/Uart_Send_8 ----
current_bd_instance /Uart_Blocks/Uart_8/Uart_Send_8
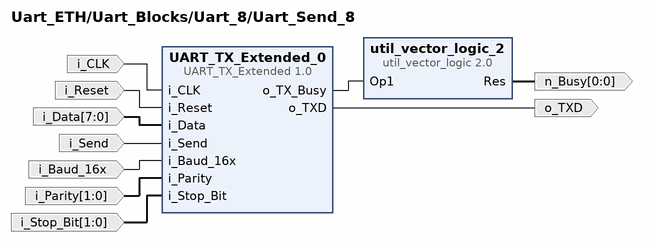
[diagram p23: block diagram inside /Uart_Blocks/Uart_8/Uart_Send_8]
create_bd_pin -dir O -from 0 -to 0 n_Busy
create_bd_pin -dir I -type clk i_CLK
create_bd_pin -dir I -type rst i_Reset
create_bd_pin -dir I -from 7 -to 0 i_Data
create_bd_pin -dir I i_Send
create_bd_pin -dir O o_TXD
create_bd_pin -dir I i_Baud_16x
create_bd_pin -dir I -from 1 -to 0 i_Parity
create_bd_pin -dir I -from 1 -to 0 i_Stop_Bit

create_bd_cell -type ip -vlnv xilinx.com:ip:util_vector_logic:2.0 util_vector_logic_2
set_property -dict {CONFIG.C_SIZE 1 CONFIG.C_OPERATION not} [get_bd_cells util_vector_logic_2]
create_bd_cell -type ip -vlnv xilinx.com:user:UART_TX_Extended:1.0 UART_TX_Extended_0

# ---- hierarchy /Uart_Blocks/Uart_9 ----
current_bd_instance /Uart_Blocks/Uart_9
